# Altium schematic sheet EVENTCTRL_CAL.SchDoc: CAL
size A4; Author: ZLY; DocumentNumber: 9321-E-1102-EMRT EVENT CONTROLLER ACQ; Revision: 1.0; SheetNumber: 3; SheetTotal: 6
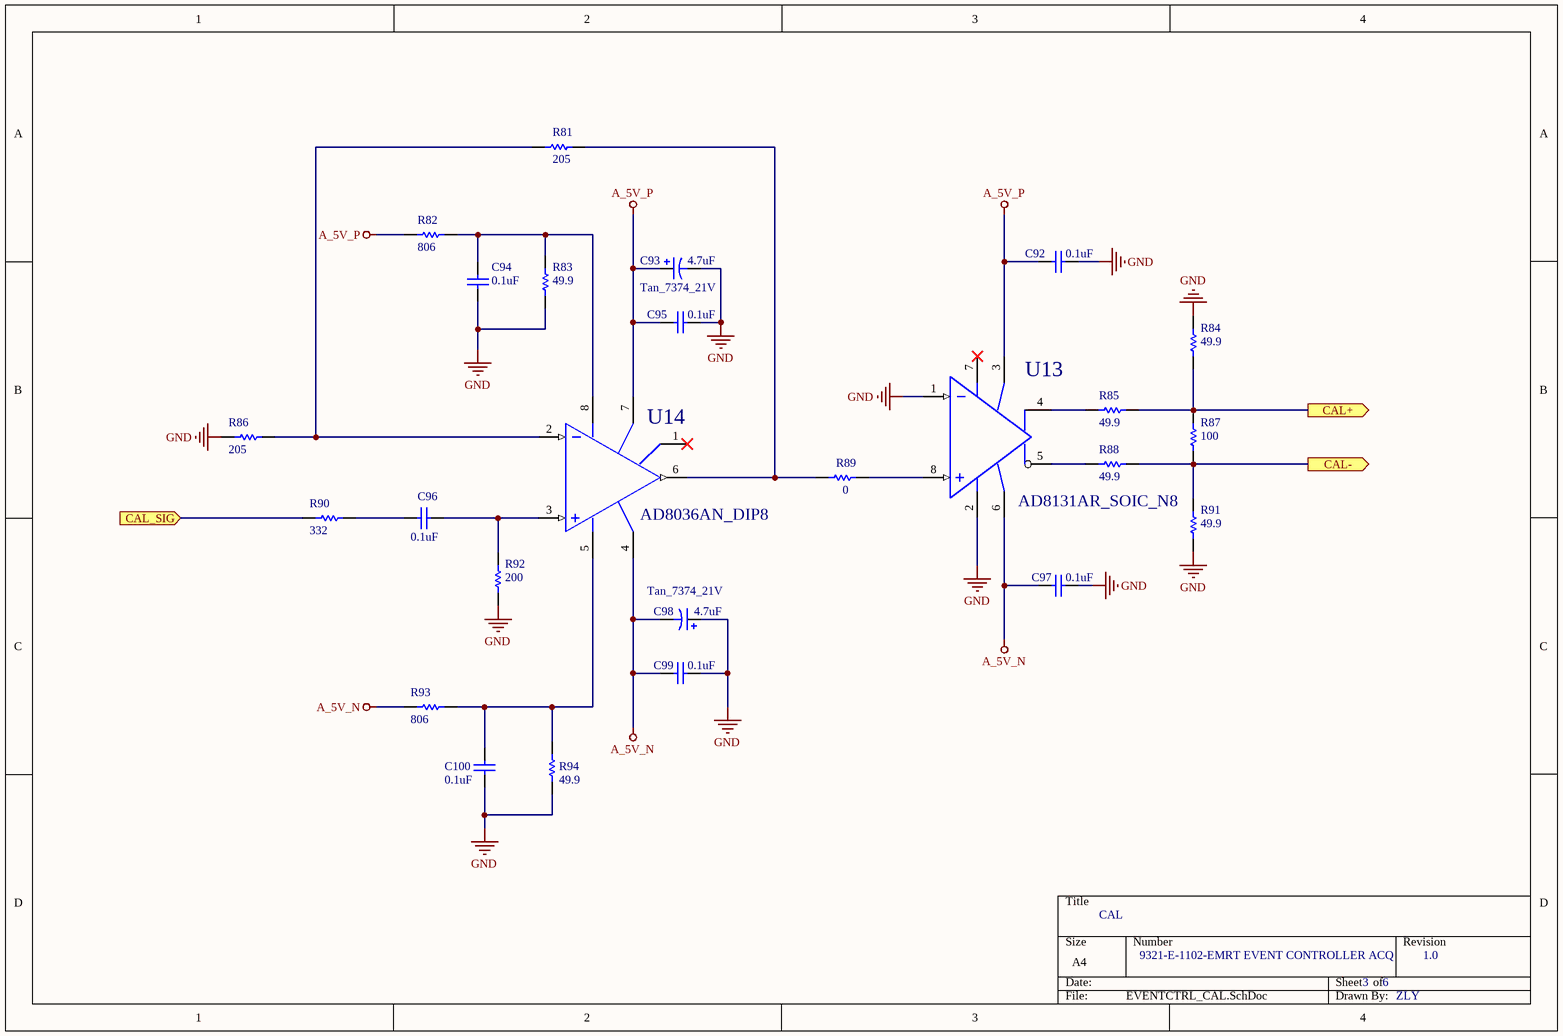
[diagram p0: EVENTCTRL_CAL.SchDoc]

## Parts
C92  value 0.1uF  [0805]  (hidden comment: C0805)
C93  Tan_7374_21V  value 4.7uF  [7343]
C94  value 0.1uF  [0805]  (hidden comment: C0805)
C95  value 0.1uF  [0805]  (hidden comment: C0805)
C96  value 0.1uF  [0805]  (hidden comment: C0805)
C97  value 0.1uF  [0805]  (hidden comment: C0805)
C98  Tan_7374_21V  value 4.7uF  [7343]
C99  value 0.1uF  [0805]  (hidden comment: C0805)
C100  value 0.1uF  [0805]  (hidden comment: C0805)
R81  value 205  [R0805]  (hidden comment: R0805)
R82  value 806  [R0805]  (hidden comment: R0805)
R83  value 49.9  [R0805]  (hidden comment: R0805)
R84  value 49.9  [R0805]  (hidden comment: R0805)
R85  value 49.9  [R0805]  (hidden comment: R0805)
R86  value 205  [R0805]  (hidden comment: R0805)
R87  value 100  [R0805]  (hidden comment: R0805)
R88  value 49.9  [R0805]  (hidden comment: R0805)
R89  value 0  [R0805]  (hidden comment: R0805)
R90  value 332  [R0805]  (hidden comment: R0805)
R91  value 49.9  [R0805]  (hidden comment: R0805)
R92  value 200  [R0805]  (hidden comment: R0805)
R93  value 806  [R0805]  (hidden comment: R0805)
R94  value 49.9  [R0805]  (hidden comment: R0805)
U13  AD8131AR_SOIC_N8  [SO-8]
U14  AD8036AN_DIP8  [DIP8]

## Ports
CAL+ (out), CAL- (out), CAL_SIG (in)

## Nets
A_5V_N: C97.1 C98.2 C99.1 R93.1 U13.6(V-) U14.4(V-)
A_5V_P: C92.1 C93.1 C95.1 R82.1 U13.3(V+) U14.7(V+)
GND: C92.2 C93.2 C94.1 C95.2 C97.2 C98.1 C99.2 C100.1 R83.1 R84.2 R86.1 R91.1 R92.1 R94.1 U13.1(Din-) U13.2(Vcom)
CAL+: R84.1 R85.2 R87.2 ; port CAL+
CAL-: R87.1 R88.2 R91.2 ; port CAL-
CAL_SIG: R90.1 ; port CAL_SIG
NetC94_2: C94.2 R82.2 R83.2 U14.8(V+)
NetC96_1: C96.1 R90.2
NetC96_2: C96.2 R92.2 U14.3(IN+)
NetC100_2: C100.2 R93.2 R94.2 U14.5(V-)
NetR81_1: R81.1 R86.2 U14.2(IN-)
NetR81_2: R81.2 R89.1 U14.6(OUT)
NetR85_1: R85.1 U13.4(OUT+)
NetR88_1: R88.1 U13.5(OUT-)
NetR89_2: R89.2 U13.8(Din+)

Not connected (* = marked no-connect by the designer): U13 7(NC)*; U14 1(NC)*

## Library data of the parts
C92 C94-C97 C99 C100 = Cap: Capacitor; PackageReference: C0805
C93 C98 = Cap Pol1: Polarized Capacitor (Radial)
R81-R94 = Res1: Resistor; PackageReference: R0805
U13 = AD8131AR
U14 = AD8036AN